# EAGLE design NuMulti_Adaptor_Board (EAGLE 6.3)
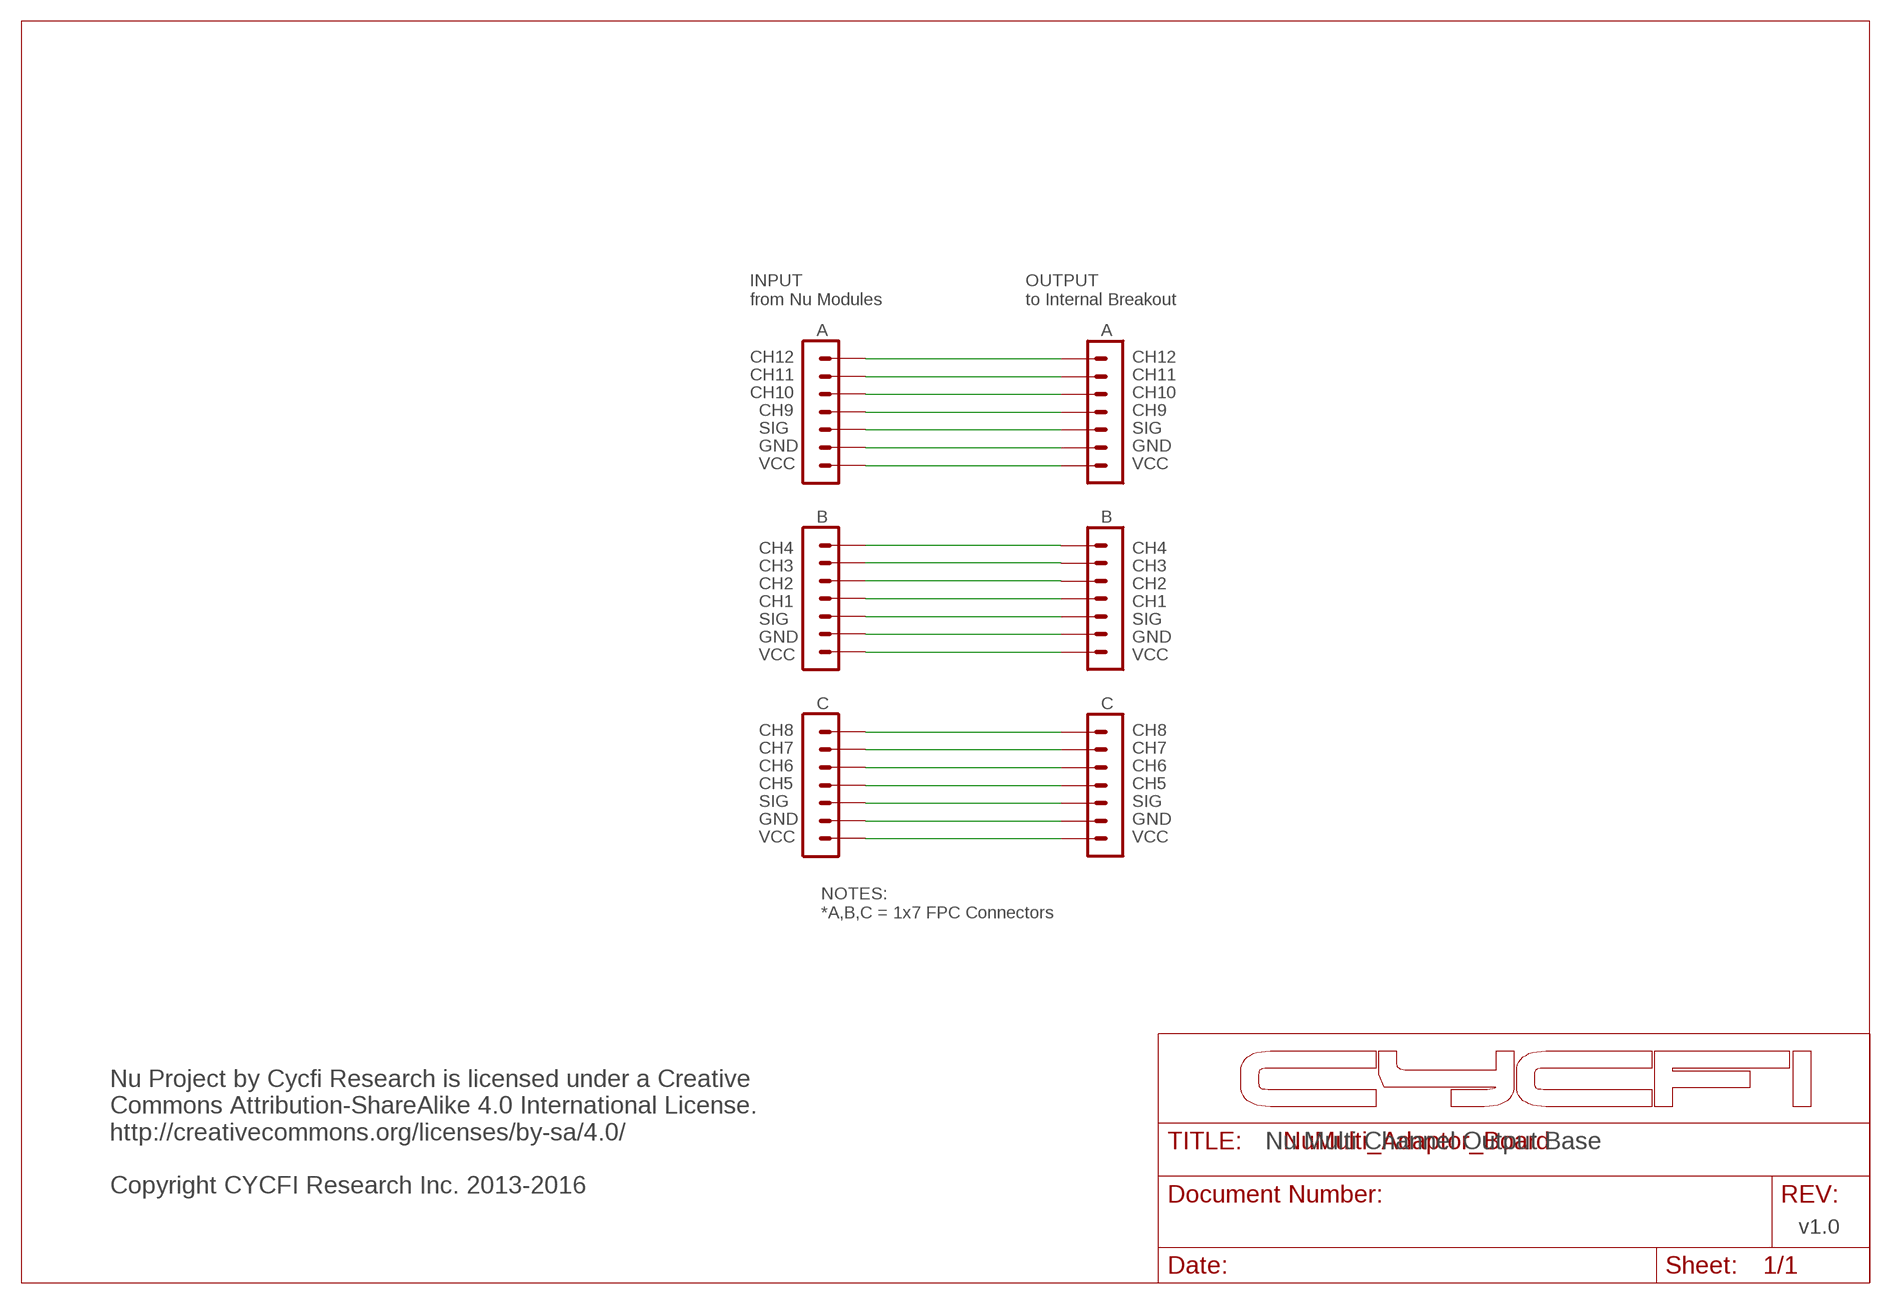
[diagram p0: schematic, sheet 1]

## Parts
H1  7P_ZIF_59453-071110EDHLF  [7P_ZIF_59453-071110EDHLF]
H2  7P_ZIF_59453-071110EDHLF  [7P_ZIF_59453-071110EDHLF]
H3  7P_ZIF_59453-071110EDHLF  [7P_ZIF_59453-071110EDHLF]
H4  7P_ZIF_59453-071110EDHLF  [7P_ZIF_59453-071110EDHLF]
H5  7P_ZIF_59453-071110EDHLF  [7P_ZIF_59453-071110EDHLF]
H6  7P_ZIF_59453-071110EDHLF  [7P_ZIF_59453-071110EDHLF]

## Nets
GND: H1.P$6 H2.P$6 H3.P$6 H4.P$6 H5.P$6 H6.P$6
N$1: H5.P$1 H6.P$1
N$2: H5.P$2 H6.P$2
N$3: H5.P$3 H6.P$3
N$4: H5.P$4 H6.P$4
N$5: H5.P$5 H6.P$5
N$7: H5.P$7 H6.P$7
N$8: H2.P$7 H4.P$7
N$10: H2.P$5 H4.P$5
N$11: H2.P$4 H4.P$4
N$12: H2.P$3 H4.P$3
N$13: H2.P$2 H4.P$2
N$14: H2.P$1 H4.P$1
N$15: H1.P$7 H3.P$7
N$17: H1.P$5 H3.P$5
N$18: H1.P$4 H3.P$4
N$19: H1.P$3 H3.P$3
N$20: H1.P$2 H3.P$2
N$21: H1.P$1 H3.P$1

## Notes on the sheet
- INPUT
  from Nu Modules
- OUTPUT
  to Internal Breakout
- A | A
- CH12 | CH12
- CH11 | CH11
- CH10 | CH10
- CH9 | CH9
- SIG | SIG
- GND | GND
- VCC | VCC
- B | B
- CH4 | CH4
- CH3 | CH3
- CH2 | CH2
- CH1 | CH1
- SIG | SIG
- GND | GND
- VCC | VCC
- C | C
- CH8 | CH8
- CH7 | CH7
- CH6 | CH6
- CH5 | CH5
- SIG | SIG
- GND | GND
- VCC | VCC
- NOTES:
  *A,B,C = 1x7 FPC Connectors
- Nu Multi Channel Output Base
- Nu Project by Cycfi Research is licensed under a Creative 
  Commons Attribution-ShareAlike 4.0 International License. 
  http://creativecommons.org/licenses/by-sa/4.0/
  
  Copyright CYCFI Research Inc. 2013-2016
- v1.0

## Library data of the parts
H1-H6 = CYCFI_Con:7P_ZIF_59453-071110EDHLF

## Board
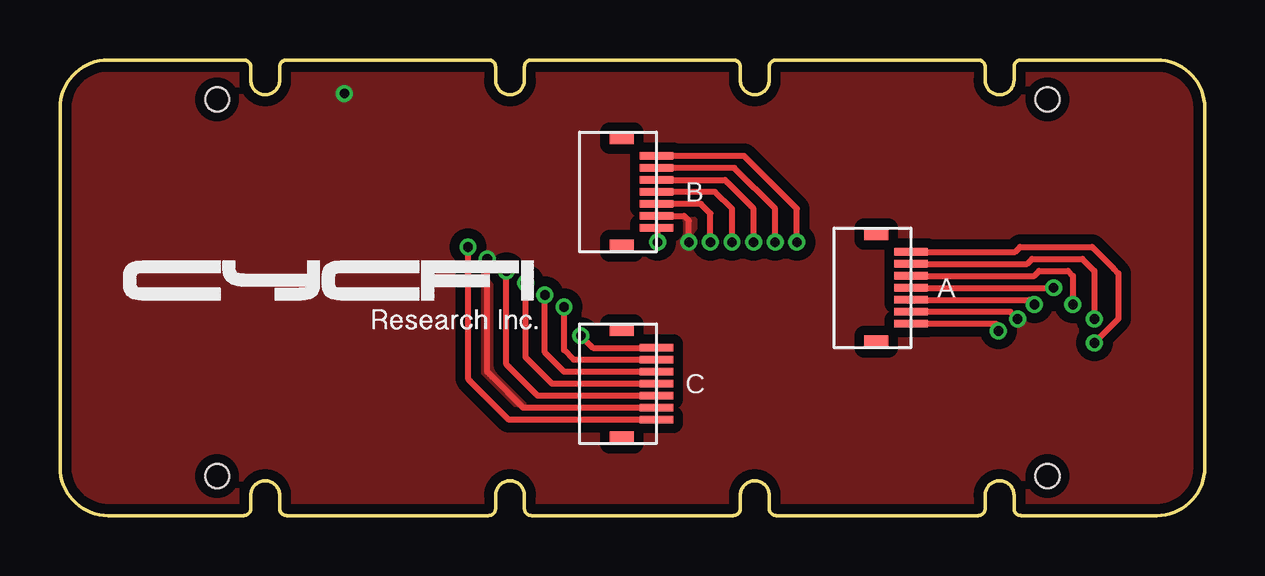
[diagram p1: board, top side]
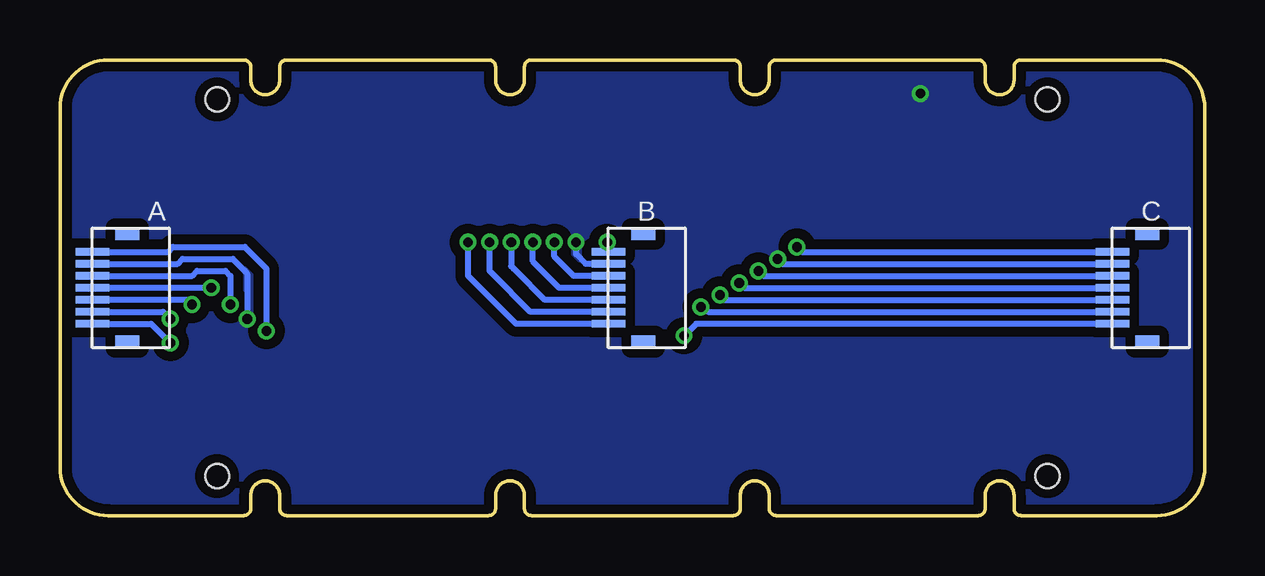
[diagram p2: board, bottom side, seen from below]

Size 47.7 x 19 mm. Coordinates in mm from the lower left corner, seen from the top.
Outline: 7.65,0 2,0 arc-90 0,2 0,17 arc-90 2,19 7.65,19 arc-90 7.95,18.7 7.95,18.15 arc90 8.55,17.55 arc90 9.15,18.15 9.15,18.7 arc-90 9.45,19 17.85,19 arc-90 18.15,18.7 18.15,18.15 arc90 18.75,17.55 arc90 19.35,18.15 19.35,18.7 arc-90 19.65,19 28.05,19 arc-90 28.35,18.7 28.35,18.15 arc90 28.95,17.55 arc90 29.55,18.15 29.55,18.7 arc-90 29.85,19 38.25,19 arc-90 38.55,18.7 38.55,18.15 arc90 39.15,17.55 arc90 39.75,18.15 39.75,18.7 arc-90 40.05,19 45.7,19 arc-90 47.7,17 47.7,2 arc-90 45.7,0 40.05,0 arc-90 39.75,0.3 39.75,0.85 arc90 39.15,1.45 arc90 38.55,0.85 38.55,0.3 arc-90 38.25,0 29.85,0 arc-90 29.55,0.3 29.55,0.85 arc90 28.95,1.45 arc90 28.35,0.85 28.35,0.3 arc-90 28.05,0 19.65,0 arc-90 19.35,0.3 19.35,0.85 arc90 18.75,1.45 arc90 18.15,0.85 18.15,0.3 arc-90 17.85,0 9.45,0 arc-90 9.15,0.3 9.15,0.85 arc90 8.55,1.45 arc90 7.95,0.85 7.95,0.3 arc-90 7.65,0
Copper layers (1*16): Top 0.035mm / dielectric 1.5mm / Bottom 0.035mm
Design rules "Fusion_eagle_rule_v1.1": minimum track width 6mil, minimum drill 12mil, track to track 6mil, track to pad 6mil, pad to pad 6mil, via to via 6mil, smd to smd 0mil, copper to edge 10mil, drill to drill 10mil, minimum pad ring 10mil, minimum via ring 6mil, stop-mask expansion 2mil, vias tented up to drill 100mil, thermal gap 10mil
Holes 1 mm at 6.55,17.35 6.55,1.65 41.15,17.35 41.15,1.65

### Footprints (pad centres in the part's own frame; a part is rotated, then mirrored left to right if it is on the bottom)
7P_ZIF_59453-071110EDHLF = smd 0.3 x 1.4: P$1 -1.5,1.6; P$2 -1,1.6; P$3 -0.5,1.6; P$4 0,1.6; P$5 0.5,1.6; P$6 1,1.6; P$7 1.5,1.6 | smd 0.52 x 1: ST1 -2.24,0.15; ST2 2.24,0.15

### Placement (x,y rotation side)
H1  23.25,13.5 270 top
H2  2.25,9.5 90 bottom
H3  23.25,9.5 90 bottom
H4  23.25,5.5 270 top
H5  44.75,9.5 90 bottom
H6  33.85,9.5 270 top

### Tracks (layer width: path | path; a pad name or v marks a point on that pad's centre or on a via)
GND  (via drill 0.4)
  Top 0.254: v26.2,11.4 26.2,12.3 26,12.5 H1.P$6 | H4.P$6 19.3,4.5 18,5.8 17.9,5.9 17.8,6 v17.8,10.7 | v39.9,8.2 39.6,8.5 H6.P$6
  Bottom 0.254: H3.P$6 25.8,10.5 26.2,10.9 v26.2,11.4 | v17.8,10.7 17.6,10.5 H2.P$6 | H5.P$6 42.8,10.5 42.6,10.7 40.5,10.7 40,10.2 39.9,10.1 v39.9,8.2
  other vias: 11.85,17.6
  pour Bottom (isolate 0.406): 2,19 45.7,19 arc-90 47.7,17 47.7,2 arc-90 45.7,0 2,0 arc-90 0,2 0,17 arc-90
  pour Top (isolate 0.406): 2,19 45.7,19 arc-90 47.7,17 47.7,2 arc-90 45.7,0 2,0 arc-90 0,2 0,17 arc-90
N$1  (via drill 0.4)
  Top 0.254: H6.P$1 39.8,11 40,11.2 43,11.2 43.9,10.3 44.1,10.1 44.1,8.2 v43.1,7.2
  Bottom 0.254: H5.P$1 43.9,8 v43.1,7.2
N$2  (via drill 0.4)
  Top 0.254: H6.P$2 40.3,10.5 40.5,10.7 42.6,10.7 43.1,10.2 v43.1,8.2
  Bottom 0.254: H5.P$2 43.4,8.5 v43.1,8.2
N$3  (via drill 0.4)
  Top 0.254: H6.P$3 40.6,10 40.8,10.2 42,10.2 42.2,10 v42.2,8.8
  Bottom 0.254: v42.2,8.8 42.2,9 H5.P$3
N$4  (via drill 0.4)
  Top 0.254: H6.P$4 v41.4,9.5
  Bottom 0.254: v41.4,9.5 H5.P$4
N$5  (via drill 0.4)
  Top 0.254: H6.P$5 40.4,9 v40.6,8.8
  Bottom 0.254: H5.P$5 42.2,10 42,10.2 40.8,10.2 40.6,10 v40.6,8.8
N$7  (via drill 0.4)
  Top 0.254: v39.1,7.7 39.1,7.9 39,8 H6.P$7
  Bottom 0.254: H5.P$7 43.2,11 43,11.2 40,11.2 39.1,10.3 v39.1,7.7
N$8  (via drill 0.4)
  Top 0.254: H4.P$7 18.7,4 17.1,5.6 17,5.7 v17,11.2
  Bottom 0.254: v17,11.2 16.8,11 H2.P$7
N$10  (via drill 0.4)
  Top 0.254: H4.P$5 19.9,5 18.7,6.2 18.6,6.3 v18.6,10.2
  Bottom 0.254: v18.6,10.2 18.4,10 H2.P$5
N$11  (via drill 0.4)
  Top 0.254: H4.P$4 20.5,5.5 19.5,6.5 19.4,6.6 v19.4,9.7
  Bottom 0.254: v19.4,9.7 19.2,9.5 H2.P$4
N$12  (via drill 0.4)
  Top 0.254: H4.P$3 21,6 20.4,6.6 20.2,6.8 v20.2,9.2
  Bottom 0.254: v20.2,9.2 20,9 H2.P$3
N$13  (via drill 0.4)
  Top 0.254: H4.P$2 21.4,6.5 21,6.9 v21,8.7
  Bottom 0.254: v21,8.7 20.9,8.7 20.7,8.5 H2.P$2
N$14  (via drill 0.4)
  Top 0.254: v21.7,7.5 22.2,7 H4.P$1
  Bottom 0.254: H2.P$1 20.9,8 21.2,8 v21.7,7.5
N$15  (via drill 0.4)
  Top 0.254: v24.9,11.4 24.9,11.95 H1.P$7
  Bottom 0.254: H3.P$7 24.85,11.35 v24.9,11.4
N$17  (via drill 0.4)
  Top 0.254: v27.1,11.4 27.1,12.6 26.7,13 H1.P$5
  Bottom 0.254: H3.P$5 26.3,10 27.1,10.8 v27.1,11.4
N$18  (via drill 0.4)
  Top 0.254: v28,11.4 28,12.8 27.3,13.5 H1.P$4
  Bottom 0.254: H3.P$4 26.9,9.5 27.9,10.5 28,10.6 v28,11.4
N$19  (via drill 0.4)
  Top 0.254: H1.P$3 27.7,14 27.8,13.9 28.8,12.9 28.9,12.8 v28.9,11.4
  Bottom 0.254: H3.P$3 27.5,9 28.7,10.2 28.8,10.3 28.9,10.4 v28.9,11.4
N$20  (via drill 0.4)
  Top 0.254: v29.8,11.4 29.8,12.8 28.1,14.5 H1.P$2
  Bottom 0.254: H3.P$2 28.1,8.5 29.7,10.1 29.8,10.2 v29.8,11.4
N$21  (via drill 0.4)
  Top 0.254: v30.7,11.4 30.7,12.8 28.7,14.8 28.5,15 H1.P$1
  Bottom 0.254: H3.P$1 26.1,8 28.7,8 30.5,9.8 30.7,10 v30.7,11.4

### Text on the board
tNames: B | A | C
bNames: C | B | A